# EAGLE schematic Display circuit v26 (EAGLE 9.7.0)
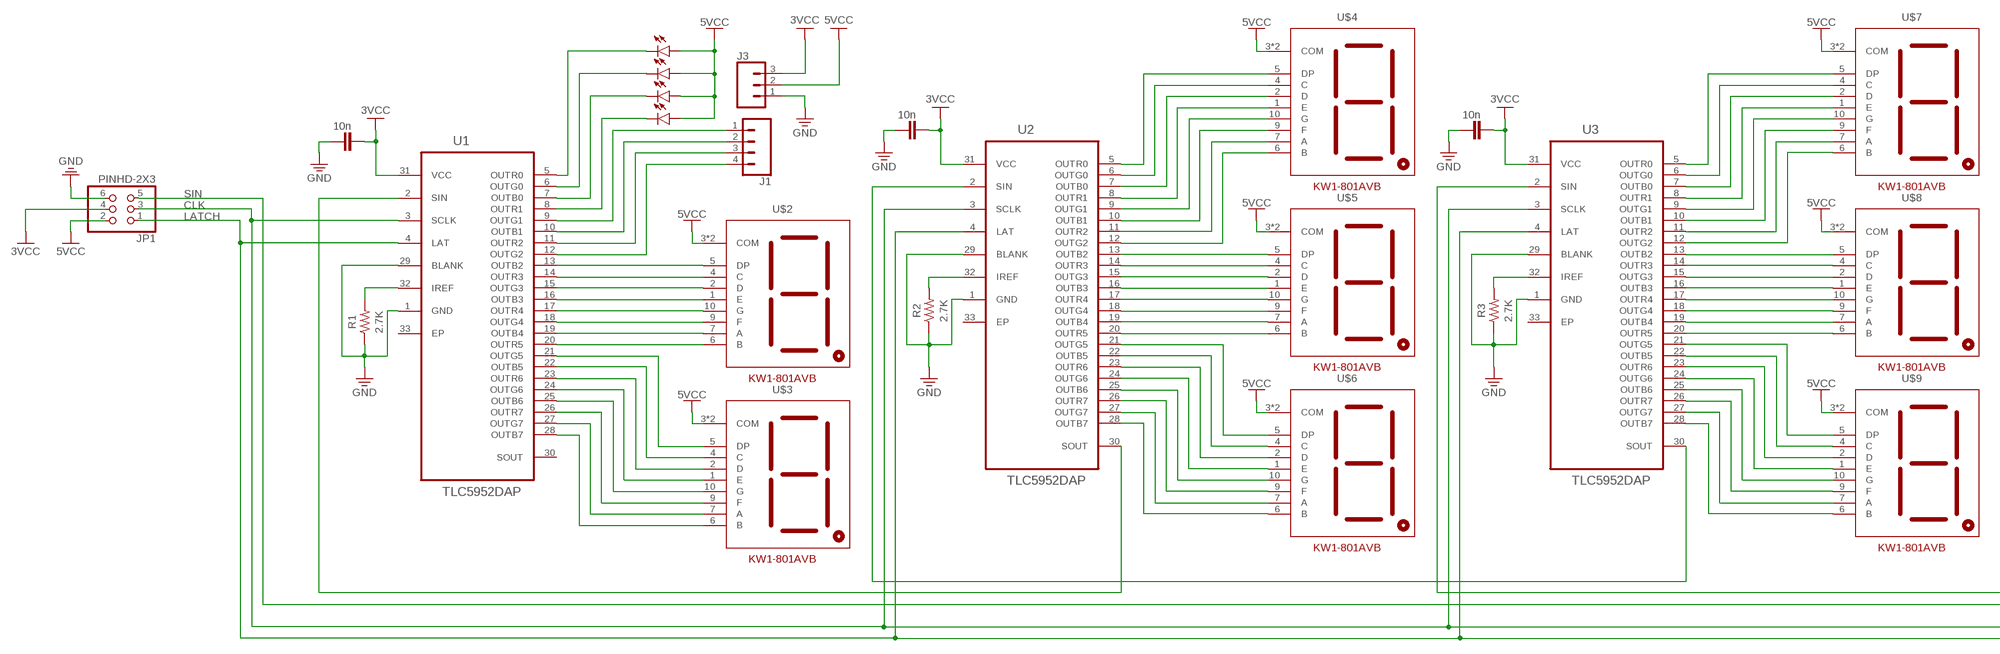
[diagram p0: schematic, sheet 1, part 1 of 2]
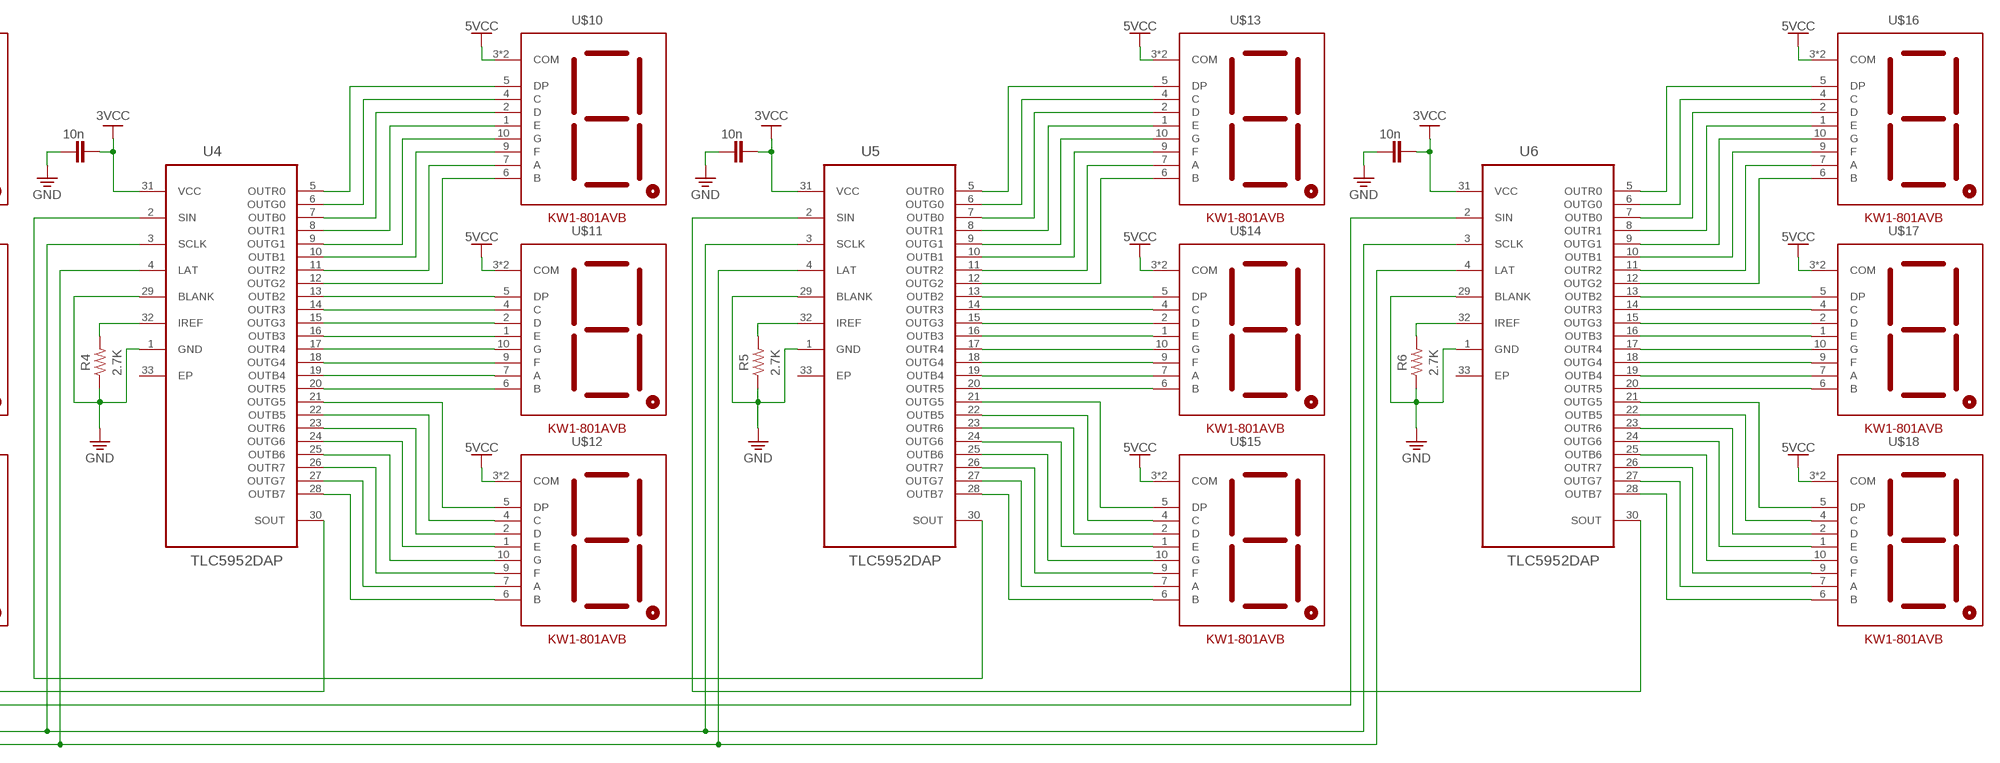
[diagram p1: schematic, sheet 1, part 2 of 2]

## Parts
C1  10n  C_CHIP-0603(1608-METRIC)  [CAPC1608X85]
C2  10n  C_CHIP-0603(1608-METRIC)  [CAPC1608X85]
C3  10n  C_CHIP-0603(1608-METRIC)  [CAPC1608X85]
C4  10n  C_CHIP-0603(1608-METRIC)  [CAPC1608X85]
C5  10n  C_CHIP-0603(1608-METRIC)  [CAPC1608X85]
C6  10n  C_CHIP-0603(1608-METRIC)  [CAPC1608X85]
J1  CONN_04PTH  [1X04]
J3  455-1750-1-ND  CONN_03  [1X03]
JP1  PINHD-2X3  [2X03]
R1  2.7K  R-US_CHIP-0603(1608-METRIC)  [RESC1608X60]
R2  2.7K  R-US_CHIP-0603(1608-METRIC)  [RESC1608X60]
R3  2.7K  R-US_CHIP-0603(1608-METRIC)  [RESC1608X60]
R4  2.7K  R-US_CHIP-0603(1608-METRIC)  [RESC1608X60]
R5  2.7K  R-US_CHIP-0603(1608-METRIC)  [RESC1608X60]
R6  2.7K  R-US_CHIP-0603(1608-METRIC)  [RESC1608X60]
U1  TLC5952DAP  [SOP65P810X120-33N]
U2  TLC5952DAP  [SOP65P810X120-33N]
U3  TLC5952DAP  [SOP65P810X120-33N]
U4  TLC5952DAP  [SOP65P810X120-33N]
U5  TLC5952DAP  [SOP65P810X120-33N]
U6  TLC5952DAP  [SOP65P810X120-33N]
U$1  WP424IDT  [WP424IDT]
U$2  KW1-801AVB  [KW1-801AVB-FOOTPRINT]
U$3  KW1-801AVB  [KW1-801AVB-FOOTPRINT]
U$4  KW1-801AVB  [KW1-801AVB-FOOTPRINT]
U$5  KW1-801AVB  [KW1-801AVB-FOOTPRINT]
U$6  KW1-801AVB  [KW1-801AVB-FOOTPRINT]
U$7  KW1-801AVB  [KW1-801AVB-FOOTPRINT]
U$8  KW1-801AVB  [KW1-801AVB-FOOTPRINT]
U$9  KW1-801AVB  [KW1-801AVB-FOOTPRINT]
U$10  KW1-801AVB  [KW1-801AVB-FOOTPRINT]
U$11  KW1-801AVB  [KW1-801AVB-FOOTPRINT]
U$12  KW1-801AVB  [KW1-801AVB-FOOTPRINT]
U$13  KW1-801AVB  [KW1-801AVB-FOOTPRINT]
U$14  KW1-801AVB  [KW1-801AVB-FOOTPRINT]
U$15  KW1-801AVB  [KW1-801AVB-FOOTPRINT]
U$16  KW1-801AVB  [KW1-801AVB-FOOTPRINT]
U$17  KW1-801AVB  [KW1-801AVB-FOOTPRINT]
U$18  KW1-801AVB  [KW1-801AVB-FOOTPRINT]
U$19  WP424IDT  [WP424IDT]
U$20  WP424IDT  [WP424IDT]
U$21  WP424IDT  [WP424IDT]

## Nets
3VCC: C1.1 C2.1 C3.1 C4.1 C5.1 C6.1 J3.3 JP1.4 U1.31(VCC) U2.31(VCC) U3.31(VCC) U4.31(VCC) U5.31(VCC) U6.31(VCC)
5VCC: J3.2 JP1.2 U$1.AN(A) U$2.3(COM) U$2.8(COM) U$3.3(COM) U$3.8(COM) U$4.3(COM) U$4.8(COM) U$5.3(COM) U$5.8(COM) U$6.3(COM) U$6.8(COM) U$7.3(COM) U$7.8(COM) U$8.3(COM) U$8.8(COM) U$9.3(COM) U$9.8(COM) U$10.3(COM) U$10.8(COM) U$11.3(COM) U$11.8(COM) U$12.3(COM) U$12.8(COM) U$13.3(COM) U$13.8(COM) U$14.3(COM) U$14.8(COM) U$15.3(COM) U$15.8(COM) U$16.3(COM) U$16.8(COM) U$17.3(COM) U$17.8(COM) U$18.3(COM) U$18.8(COM) U$19.AN(A) U$20.AN(A) U$21.AN(A)
B1 [segments]: J1.2 U1.10(OUTB1)
CLK: JP1.3 U1.3(SCLK) U2.3(SCLK) U3.3(SCLK) U4.3(SCLK) U5.3(SCLK) U6.3(SCLK)
G1 [segments]: J1.1 U1.9(OUTG1)
G2 [segments]: J1.4 U1.12(OUTG2)
GND: C1.2 C2.2 C3.2 C4.2 C5.2 C6.2 J3.1 JP1.6 R1.1 R2.1 R3.1 R4.1 R5.1 R6.1 U1.1(GND) U1.29(BLANK) U2.1(GND) U2.29(BLANK) U3.1(GND) U3.29(BLANK) U4.1(GND) U4.29(BLANK) U5.1(GND) U5.29(BLANK) U6.1(GND) U6.29(BLANK)
LATCH: JP1.1 U1.4(LAT) U2.4(LAT) U3.4(LAT) U4.4(LAT) U5.4(LAT) U6.4(LAT)
N$1 [segments]: U2.10(OUTB1) U$4.9(F)
N$2 [segments]: U2.11(OUTR2) U$4.7(A)
N$3 [segments]: U2.12(OUTG2) U$4.6(B)
N$4 [segments]: U2.13(OUTB2) U$5.5(DP)
N$5 [segments]: U2.14(OUTR3) U$5.4(C)
N$6: R1.2 U1.32(IREF)
N$7 [segments]: U1.20(OUTR5) U$2.6(B)
N$8 [segments]: U1.19(OUTB4) U$2.7(A)
N$9 [segments]: U1.18(OUTG4) U$2.9(F)
N$10 [segments]: U1.17(OUTR4) U$2.10(G)
N$11 [segments]: U1.16(OUTB3) U$2.1(E)
N$12 [segments]: U1.15(OUTG3) U$2.2(D)
N$13 [segments]: U1.14(OUTR3) U$2.4(C)
N$14 [segments]: U1.13(OUTB2) U$2.5(DP)
N$15 [segments]: U4.13(OUTB2) U$11.5(DP)
N$16 [segments]: U2.15(OUTG3) U$5.2(D)
N$17 [segments]: U1.21(OUTG5) U$3.5(DP)
N$18 [segments]: U1.22(OUTB5) U$3.4(C)
N$19 [segments]: U1.23(OUTR6) U$3.2(D)
N$20 [segments]: U1.24(OUTG6) U$3.1(E)
N$21 [segments]: U1.25(OUTB6) U$3.10(G)
N$22 [segments]: U1.26(OUTR7) U$3.9(F)
N$23 [segments]: U1.27(OUTG7) U$3.7(A)
N$24 [segments]: U1.28(OUTB7) U$3.6(B)
N$25 [segments]: U2.16(OUTB3) U$5.1(E)
N$26 [segments]: U2.17(OUTR4) U$5.10(G)
N$27 [segments]: U2.18(OUTG4) U$5.9(F)
N$28 [segments]: U2.19(OUTB4) U$5.7(A)
N$29 [segments]: U2.20(OUTR5) U$5.6(B)
N$30 [segments]: U4.10(OUTB1) U$10.9(F)
N$31 [segments]: U2.21(OUTG5) U$6.5(DP)
N$32 [segments]: U2.22(OUTB5) U$6.4(C)
N$33 [segments]: U2.23(OUTR6) U$6.2(D)
N$34 [segments]: U2.24(OUTG6) U$6.1(E)
N$35 [segments]: U2.25(OUTB6) U$6.10(G)
N$36 [segments]: U2.26(OUTR7) U$6.9(F)
N$37 [segments]: U2.27(OUTG7) U$6.7(A)
N$38 [segments]: U2.28(OUTB7) U$6.6(B)
N$39 [segments]: U2.5(OUTR0) U$4.5(DP)
N$40 [segments]: U2.6(OUTG0) U$4.4(C)
N$41 [segments]: U2.7(OUTB0) U$4.2(D)
N$42 [segments]: U2.8(OUTR1) U$4.1(E)
N$43 [segments]: U2.9(OUTG1) U$4.10(G)
N$44 [segments]: U3.10(OUTB1) U$7.9(F)
N$45 [segments]: U3.11(OUTR2) U$7.7(A)
N$46 [segments]: U3.12(OUTG2) U$7.6(B)
N$47 [segments]: U4.11(OUTR2) U$10.7(A)
N$48 [segments]: U4.12(OUTG2) U$10.6(B)
N$49 [segments]: U4.21(OUTG5) U$12.5(DP)
N$50 [segments]: U4.22(OUTB5) U$12.4(C)
N$51 [segments]: U4.23(OUTR6) U$12.2(D)
N$52 [segments]: U4.24(OUTG6) U$12.1(E)
N$53 [segments]: U4.25(OUTB6) U$12.10(G)
N$54 [segments]: U4.26(OUTR7) U$12.9(F)
N$55 [segments]: U3.21(OUTG5) U$9.5(DP)
N$56 [segments]: U3.22(OUTB5) U$9.4(C)
N$57 [segments]: U3.23(OUTR6) U$9.2(D)
N$58 [segments]: U3.24(OUTG6) U$9.1(E)
N$59 [segments]: U3.25(OUTB6) U$9.10(G)
N$60 [segments]: U3.26(OUTR7) U$9.9(F)
N$61 [segments]: U3.27(OUTG7) U$9.7(A)
N$62 [segments]: U3.28(OUTB7) U$9.6(B)
N$63 [segments]: U3.5(OUTR0) U$7.5(DP)
N$64 [segments]: U3.6(OUTG0) U$7.4(C)
N$65 [segments]: U3.7(OUTB0) U$7.2(D)
N$66 [segments]: U3.8(OUTR1) U$7.1(E)
N$67 [segments]: U3.9(OUTG1) U$7.10(G)
N$68 [segments]: U4.27(OUTG7) U$12.7(A)
N$69 [segments]: U4.28(OUTB7) U$12.6(B)
N$70 [segments]: U4.5(OUTR0) U$10.5(DP)
N$71 [segments]: U4.6(OUTG0) U$10.4(C)
N$72 [segments]: U4.7(OUTB0) U$10.2(D)
N$73 [segments]: U4.8(OUTR1) U$10.1(E)
N$74 [segments]: U4.9(OUTG1) U$10.10(G)
N$75 [segments]: U4.14(OUTR3) U$11.4(C)
N$76 [segments]: U4.15(OUTG3) U$11.2(D)
N$77 [segments]: U4.16(OUTB3) U$11.1(E)
N$78 [segments]: U3.13(OUTB2) U$8.5(DP)
N$79 [segments]: U4.17(OUTR4) U$11.10(G)
N$80 [segments]: U4.18(OUTG4) U$11.9(F)
N$81 [segments]: U4.19(OUTB4) U$11.7(A)
N$82 [segments]: U4.20(OUTR5) U$11.6(B)
N$83 [segments]: U5.13(OUTB2) U$14.5(DP)
N$84 [segments]: U5.10(OUTB1) U$13.9(F)
N$85 [segments]: U5.11(OUTR2) U$13.7(A)
N$86 [segments]: U5.12(OUTG2) U$13.6(B)
N$87 [segments]: U5.21(OUTG5) U$15.5(DP)
N$88 [segments]: U5.22(OUTB5) U$15.4(C)
N$89 [segments]: U5.23(OUTR6) U$15.2(D)
N$90 [segments]: U5.24(OUTG6) U$15.1(E)
N$91 [segments]: U5.25(OUTB6) U$15.10(G)
N$92 [segments]: U5.26(OUTR7) U$15.9(F)
N$93 [segments]: U5.27(OUTG7) U$15.7(A)
N$94 [segments]: U5.28(OUTB7) U$15.6(B)
N$95 [segments]: U3.14(OUTR3) U$8.4(C)
N$96 [segments]: U3.15(OUTG3) U$8.2(D)
N$97 [segments]: U3.16(OUTB3) U$8.1(E)
N$98 [segments]: U3.17(OUTR4) U$8.10(G)
N$99 [segments]: U3.18(OUTG4) U$8.9(F)
N$100 [segments]: U3.19(OUTB4) U$8.7(A)
N$101 [segments]: U3.20(OUTR5) U$8.6(B)
N$102 [segments]: U5.5(OUTR0) U$13.5(DP)
N$103 [segments]: U5.6(OUTG0) U$13.4(C)
N$104 [segments]: U5.7(OUTB0) U$13.2(D)
N$105 [segments]: U5.8(OUTR1) U$13.1(E)
N$106 [segments]: U5.9(OUTG1) U$13.10(G)
N$107 [segments]: U5.14(OUTR3) U$14.4(C)
N$108 [segments]: U5.15(OUTG3) U$14.2(D)
N$109 [segments]: U5.16(OUTB3) U$14.1(E)
N$110 [segments]: U5.17(OUTR4) U$14.10(G)
N$111 [segments]: U5.18(OUTG4) U$14.9(F)
N$112 [segments]: U5.19(OUTB4) U$14.7(A)
N$114: U5.2(SIN) U6.30(SOUT)
N$115: U4.2(SIN) U5.30(SOUT)
N$116: U3.2(SIN) U4.30(SOUT)
N$117: U2.2(SIN) U3.30(SOUT)
N$118: U1.2(SIN) U2.30(SOUT)
N$119 [segments]: U5.20(OUTR5) U$14.6(B)
N$121: R4.2 U4.32(IREF)
N$122: R3.2 U3.32(IREF)
N$123: R2.2 U2.32(IREF)
N$124 [segments]: U6.13(OUTB2) U$17.5(DP)
N$125: R5.2 U5.32(IREF)
N$126 [segments]: U6.14(OUTR3) U$17.4(C)
N$127 [segments]: U6.10(OUTB1) U$16.9(F)
N$128 [segments]: U6.11(OUTR2) U$16.7(A)
N$129 [segments]: U6.12(OUTG2) U$16.6(B)
N$130 [segments]: U6.21(OUTG5) U$18.5(DP)
N$131 [segments]: U6.22(OUTB5) U$18.4(C)
N$132 [segments]: U6.23(OUTR6) U$18.2(D)
N$133 [segments]: U6.24(OUTG6) U$18.1(E)
N$134 [segments]: U6.25(OUTB6) U$18.10(G)
N$135 [segments]: U6.26(OUTR7) U$18.9(F)
N$136 [segments]: U6.27(OUTG7) U$18.7(A)
N$137 [segments]: U6.28(OUTB7) U$18.6(B)
N$138 [segments]: U6.5(OUTR0) U$16.5(DP)
N$139: R6.2 U6.32(IREF)
N$140 [segments]: U6.15(OUTG3) U$17.2(D)
N$141 [segments]: U6.6(OUTG0) U$16.4(C)
N$142 [segments]: U6.7(OUTB0) U$16.2(D)
N$143 [segments]: U6.8(OUTR1) U$16.1(E)
N$144 [segments]: U6.9(OUTG1) U$16.10(G)
N$145 [segments]: U6.16(OUTB3) U$17.1(E)
N$146 [segments]: U6.17(OUTR4) U$17.10(G)
N$147 [segments]: U6.18(OUTG4) U$17.9(F)
N$148 [segments]: U6.19(OUTB4) U$17.7(A)
N$149 [segments]: U6.20(OUTR5) U$17.6(B)
N$155 [segments]: U1.6(OUTG0) U$19.CAT(C)
N$157 [segments]: U1.8(OUTR1) U$21.CAT(C)
N$158 [segments]: U1.5(OUTR0) U$1.CAT(C)
N$159 [segments]: U1.7(OUTB0) U$20.CAT(C)
R2 [segments]: J1.3 U1.11(OUTR2)
SIN: JP1.5 U6.2(SIN)
Unconnected: U1.30(SOUT) U1.33(EP) U2.33(EP) U3.33(EP) U4.33(EP) U5.33(EP) U6.33(EP)

## Library data of the parts
C1-C6 = Capacitor:C: Capacitor - Generic; CATEGORY: Capacitor; PACKAGE_SIZE: 0603; PACKAGE_TYPE: SMD; SUBCATEGORY: Ceramic Capacitors; TYPE: MLCC
J1 = SparkFun-Connectors:CONN_04: Multi connection point. Often used as Generic Header-pin footprint for 0.1 inch spaced/style header connections On any of the 0.1 inch spaced packages, you can populate with these: Break Away Headers - Straight <https://www.sparkfun.com/products/116> (PRT-00116) Break Away Male Headers - Right Angle <https://www.sparkfun.com/products/553> (PRT-00553) Female Headers <https://www.sparkfun.com/products/115> (PRT-00115) Break Away Headers - Machine Pin <https://www.sparkfun.com/products/117> (PRT-00117) Break Away Female Headers - Swiss Machine Pin <https://www.sparkfun.com/products/743> (PRT-00743) For SCREWTERMINALS and SPRING TERMINALS visit here: Screw Terimnals on SparkFun.com <https://www.sparkfun.com/search/results?term=Screw+Terminals> (5mm/3.5mm/2.54mm spacing) This device is also useful as a general connection point to wire up your design to another part of your project. Our various solder wires solder well into these plated through hole pads. Hook-Up Wire - Assortment (Stranded, 22 AWG) <https://www.sparkfun.com/products/11375> (PRT-11375) Hook-Up Wire - Assortment (Solid Core, 22 AWG) <https://www.sparkfun.com/products/11367> (PRT-11367) View the entire wire category on our website here <https://www.sparkfun.com/categories/141> Special notes: Molex polarized connector foot print use with SKU : PRT-08231 with associated crimp pins and housings. 1MM SMD Version SKU: PRT-10208; PROD_ID: CONN-09696
J3 = SparkFun-Connectors:CONN_03: Multi connection point. Often used as Generic Header-pin footprint for 0.1 inch spaced/style header connections On any of the 0.1 inch spaced packages, you can populate with these: Break Away Headers - Straight <https://www.sparkfun.com/products/116> (PRT-00116) Break Away Male Headers - Right Angle <https://www.sparkfun.com/products/553> (PRT-00553) Female Headers <https://www.sparkfun.com/products/115> (PRT-00115) Break Away Headers - Machine Pin <https://www.sparkfun.com/products/117> (PRT-00117) Break Away Female Headers - Swiss Machine Pin <https://www.sparkfun.com/products/743> (PRT-00743) Stackable Header - 3 Pin (Female, 0.1") <https://www.sparkfun.com/products/13875> (PRT-13875) For SCREWTERMINALS and SPRING TERMINALS visit here: Screw Terimnals on SparkFun.com <https://www.sparkfun.com/search/results?term=Screw+Terminals> (5mm/3.5mm/2.54mm spacing) This device is also useful as a general connection point to wire up your design to another part of your project. Our various solder wires solder well into these plated through hole pads. Hook-Up Wire - Assortment (Stranded, 22 AWG) <https://www.sparkfun.com/products/11375> (PRT-11375) Hook-Up Wire - Assortment (Solid Core, 22 AWG) <https://www.sparkfun.com/products/11367> (PRT-11367) View the entire wire category on our website here <https://www.sparkfun.com/categories/141> Special notes: Molex polarized connector foot print use with SKU : PRT-08232 with associated crimp pins and housings.; PROD_ID: XXX-00000
JP1 = Connector:PINHD-2X3: PIN HEADER; CATEGORY: Headers; DESCRIPTION: Header-Straight-2x3 Position; PACKAGE_TYPE: THT; PITCH: 0.100" (2.54mm); SUBCATEGORY: Headers-Male Pins; TYPE: Board to Board or Cable-Unshrouded-Through Hole-Straight
R1-R6 = Resistor:R-US: Resistor Fixed - ANSI; CATEGORY: Resistors; DESCRIPTION: Chip Resistor 1.60 X 0.82 X 0.60 mm body 0603(1608-METRIC) Package; PACKAGE_SIZE: 0603; PACKAGE_TYPE: SMD
U1-U6 = SnapEDA Library:TLC5952DAP: 24-Channel, Constant-Current LED Driver; MPN: TLC5952DAP; OC_FARNELL: 1755260; OC_NEWARK: 24R9993; PACKAGE: HTSSOP-32; SUPPLIER: Texas Instruments
U$1 U$19-U$21 = GPS Clock Components:WP424IDT
U$2-U$18 = GPS Clock Components:KW1-801AVB